# Altium schematic sheet Test.SchDoc
size A; SheetNumber: 1; SheetTotal: 1
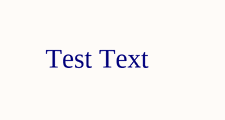
[diagram p0: Test.SchDoc]

## Notes on the sheet
- Test Text